# EAGLE design forcefoot (EAGLE 6.1)
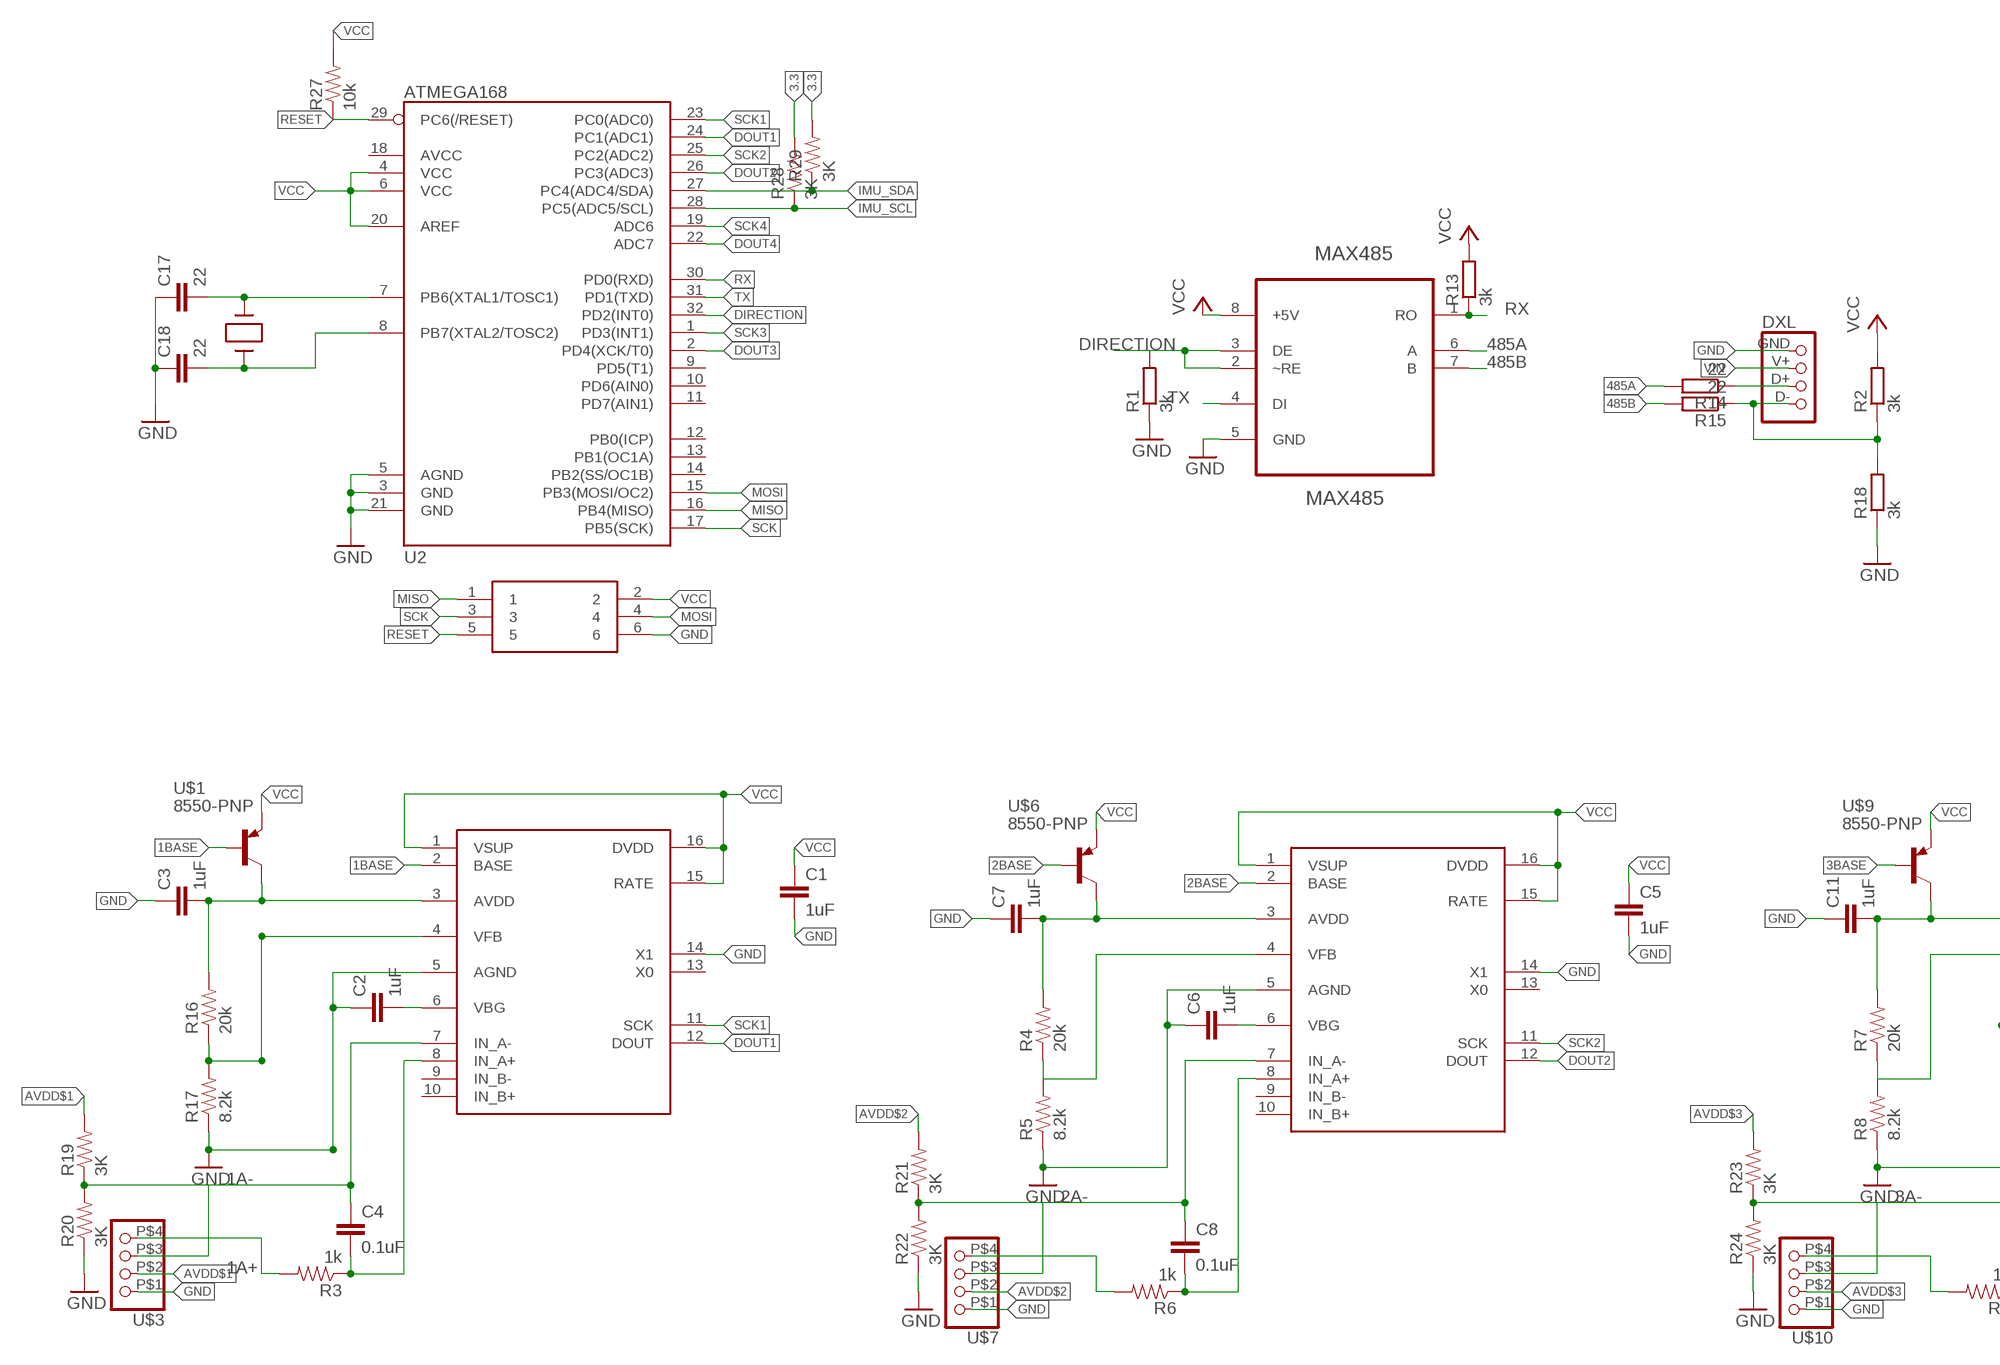
[diagram p0: schematic, sheet 1, part 1 of 2]
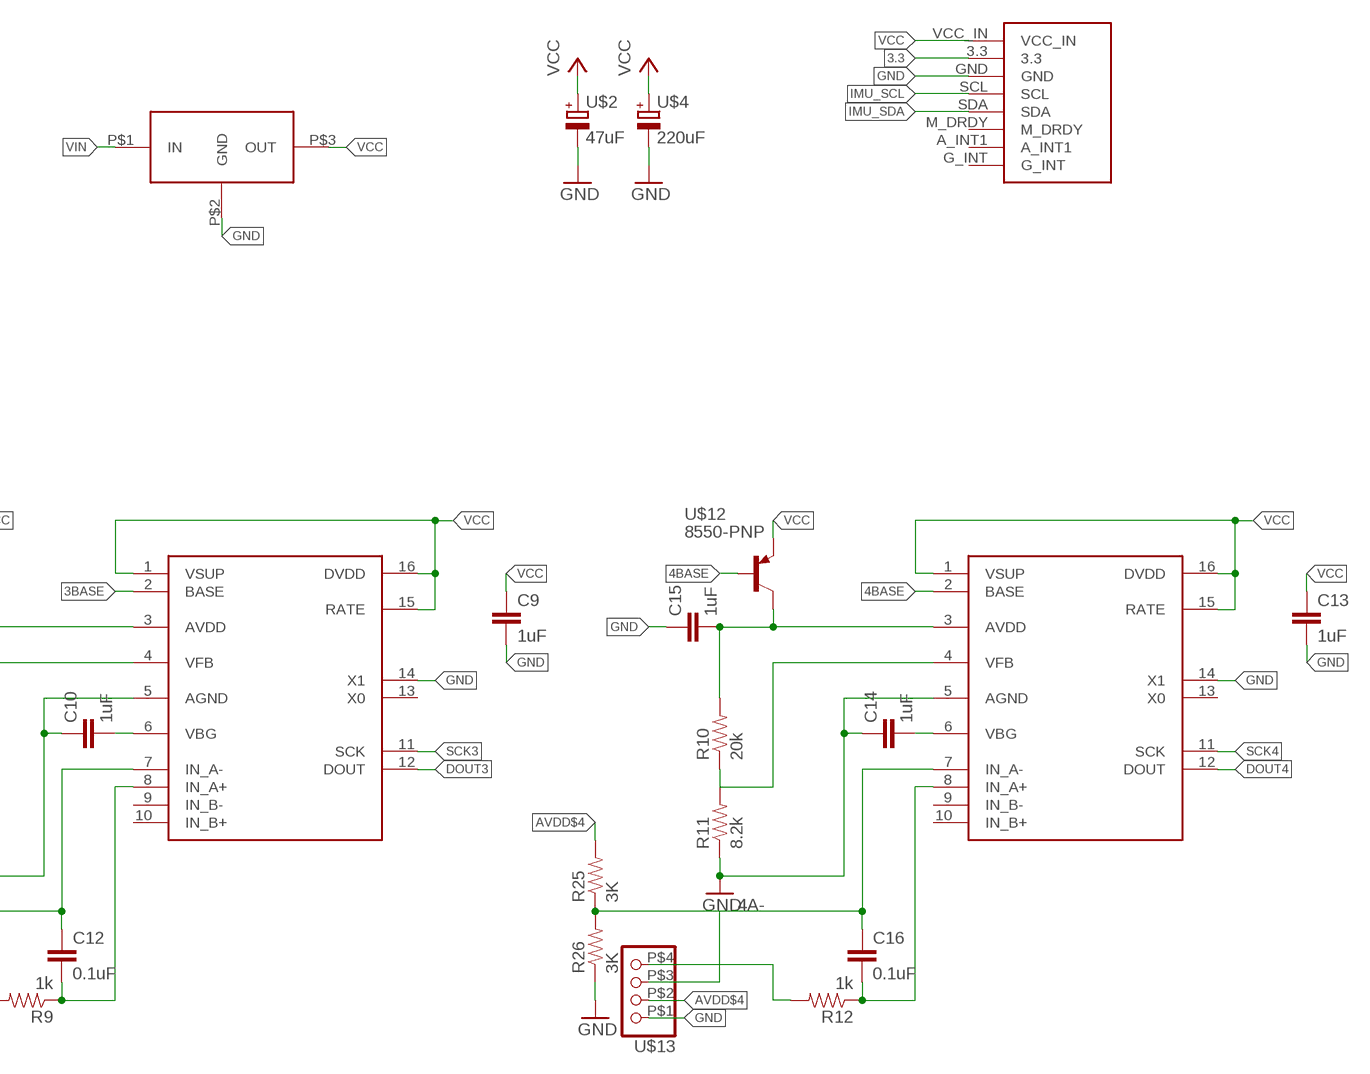
[diagram p1: schematic, sheet 1, part 2 of 2]

## Parts
C1  1uF  CAP0805  [0805]
C2  1uF  CAP0805  [0805]
C3  1uF  CAP0805  [0805]
C4  0.1uF  CAP0805  [0805]
C5  1uF  CAP0805  [0805]
C6  1uF  CAP0805  [0805]
C7  1uF  CAP0805  [0805]
C8  0.1uF  CAP0805  [0805]
C9  1uF  CAP0805  [0805]
C10  1uF  CAP0805  [0805]
C11  1uF  CAP0805  [0805]
C12  0.1uF  CAP0805  [0805]
C13  1uF  CAP0805  [0805]
C14  1uF  CAP0805  [0805]
C15  1uF  CAP0805  [0805]
C16  0.1uF  CAP0805  [0805]
C17  22  C_EU_22PF  [C0603]
C18  22  C_EU_22PF  [C0603]
DXL  CONNEC_1X04_485  [CONNEC_485]
HX1  HX711SO16  [SO16]
HX2  HX711SO16  [SO16]
HX3  HX711SO16  [SO16]
HX4  HX711SO16  [SO16]
IMU  GY-85  [GY-85]
ISP  CONNEC_2X03  [CONNEC_2X03]
MAX485  MAX485  [SO8]
R1  3k  RESISTANCE-R0805  [R0805]
R2  3k  RESISTANCE-R0805  [R0805]
R3  1k  RESISTOR0805-RES  [0805]
R4  20k  RESISTOR0805-RES  [0805]
R5  8.2k  RESISTOR0805-RES  [0805]
R6  1k  RESISTOR0805-RES  [0805]
R7  20k  RESISTOR0805-RES  [0805]
R8  8.2k  RESISTOR0805-RES  [0805]
R9  1k  RESISTOR0805-RES  [0805]
R10  20k  RESISTOR0805-RES  [0805]
R11  8.2k  RESISTOR0805-RES  [0805]
R12  1k  RESISTOR0805-RES  [0805]
R13  3k  RESISTANCE-R0805  [R0805]
R14  22  RESISTANCE-R0805  [R0805]
R15  22  RESISTANCE-R0805  [R0805]
R16  20k  RESISTOR0805-RES  [0805]
R17  8.2k  RESISTOR0805-RES  [0805]
R18  3k  RESISTANCE-R0805  [R0805]
R19  3K  RESISTOR0805-RES  [0805]
R20  3K  RESISTOR0805-RES  [0805]
R21  3K  RESISTOR0805-RES  [0805]
R22  3K  RESISTOR0805-RES  [0805]
R23  3K  RESISTOR0805-RES  [0805]
R24  3K  RESISTOR0805-RES  [0805]
R25  3K  RESISTOR0805-RES  [0805]
R26  3K  RESISTOR0805-RES  [0805]
R27  10k  RESISTOR0805-RES  [0805]
R28  3K  RESISTOR0805-RES  [0805]
R29  3K  RESISTOR0805-RES  [0805]
REG  REG_5V  [TRACOPOWER]
U2  ATMEGA168  [TQFP32-08]
U$1  8550-PNP  [SOT-23]
U$2  47uF  CPOL_EUPANASONIC_D  [PANASONIC_D]
U$3  CONNEC_1X041.5  [4P1.5]
U$4  220uF  CPOL_EUPANASONIC_D8  [PANASONIC_D8]
U$6  8550-PNP  [SOT-23]
U$7  CONNEC_1X041.5  [4P1.5]
U$9  8550-PNP  [SOT-23]
U$10  CONNEC_1X041.5  [4P1.5]
U$12  8550-PNP  [SOT-23]
U$13  CONNEC_1X041.5  [4P1.5]
XTAL1  QUARTZ  [HC49US]

## Nets
1A+: R3.2 U$3.P$4
1A-: C4.1 HX1.7(IN_A-) R19.1 R20.2 U$3.P$3
1BASE: HX1.2(BASE) U$1.1(B)
2A-: C8.1 HX2.7(IN_A-) R21.1 R22.2 U$7.P$3
2BASE: HX2.2(BASE) U$6.1(B)
3.3: IMU.3.3 R28.2 R29.2
3A-: C12.1 HX3.7(IN_A-) R23.1 R24.2 U$10.P$3
3BASE: HX3.2(BASE) U$9.1(B)
4A-: C16.1 HX4.7(IN_A-) R25.1 R26.2 U$13.P$3
4BASE: HX4.2(BASE) U$12.1(B)
485A: MAX485.6(A) R14.2
485B: MAX485.7(B) R15.2
AVDD$1: C3.2 HX1.3(AVDD) R16.2 R19.2 U$1.3(C) U$3.P$2
AVDD$2: C7.2 HX2.3(AVDD) R4.2 R21.2 U$6.3(C) U$7.P$2
AVDD$3: C11.2 HX3.3(AVDD) R7.2 R23.2 U$9.3(C) U$10.P$2
AVDD$4: C15.2 HX4.3(AVDD) R10.2 R25.2 U$12.3(C) U$13.P$2
DIRECTION: MAX485.2(~RE) MAX485.3(DE) R1.2 U2.32(PD2(INT0))
DOUT1: HX1.12(DOUT) U2.24(PC1(ADC1))
DOUT2: HX2.12(DOUT) U2.26(PC3(ADC3))
DOUT3: HX3.12(DOUT) U2.2(PD4(XCK/T0))
DOUT4: HX4.12(DOUT) U2.22(ADC7)
GND: C1.2 C2.1 C3.1 C5.2 C6.1 C7.1 C9.2 C10.1 C11.1 C13.2 C14.1 C15.1 C17.1 C18.1 DXL.GND HX1.5(AGND) HX1.14(X1) HX2.5(AGND) HX2.14(X1) HX3.5(AGND) HX3.14(X1) HX4.5(AGND) HX4.14(X1) IMU.GND ISP.6 MAX485.5(GND) R1.1 R5.1 R8.1 R11.1 R17.1 R18.1 R20.1 R22.1 R24.1 R26.1 REG.P$2(GND) U2.3(GND) U2.5(AGND) U2.21(GND) U$2.- U$3.P$1 U$4.- U$7.P$1 U$10.P$1 U$13.P$1
IMU_SCL: IMU.SCL R28.1 U2.28(PC5(ADC5/SCL))
IMU_SDA: IMU.SDA R29.1 U2.27(PC4(ADC4/SDA))
INAP$1: C4.2 HX1.8(IN_A+) R3.1
INAP$2: C8.2 HX2.8(IN_A+) R6.1
INAP$3: C12.2 HX3.8(IN_A+) R9.1
INAP$4: C16.2 HX4.8(IN_A+) R12.1
MISO: ISP.1 U2.16(PB4(MISO))
MOSI: ISP.4 U2.15(PB3(MOSI/OC2))
N$1: C2.2 HX1.6(VBG)
N$3: C6.2 HX2.6(VBG)
N$4: R6.2 U$7.P$4
N$5: C10.2 HX3.6(VBG)
N$6: R9.2 U$10.P$4
N$7: C14.2 HX4.6(VBG)
N$8: R12.2 U$13.P$4
N$19: C17.2 U2.7(PB6(XTAL1/TOSC1)) XTAL1.2
N$20: C18.2 U2.8(PB7(XTAL2/TOSC2)) XTAL1.1
RESET: ISP.5 R27.1 U2.29(PC6(/RESET))
RS+: DXL.D+ R14.1
RS-: DXL.D- R2.1 R15.1 R18.2
RX: MAX485.1(RO) R13.1 U2.30(PD0(RXD))
SCK: ISP.3 U2.17(PB5(SCK))
SCK1: HX1.11(SCK) U2.23(PC0(ADC0))
SCK2: HX2.11(SCK) U2.25(PC2(ADC2))
SCK3: HX3.11(SCK) U2.1(PD3(INT1))
SCK4: HX4.11(SCK) U2.19(ADC6)
TX: MAX485.4(DI) U2.31(PD1(TXD))
VCC: C1.1 C5.1 C9.1 C13.1 HX1.1(VSUP) HX1.15(RATE) HX1.16(DVDD) HX2.1(VSUP) HX2.15(RATE) HX2.16(DVDD) HX3.1(VSUP) HX3.15(RATE) HX3.16(DVDD) HX4.1(VSUP) HX4.15(RATE) HX4.16(DVDD) IMU.VCC_IN ISP.2 MAX485.8(+5V) R2.2 R13.2 R27.2 REG.P$3(OUT) U2.4(VCC) U2.6(VCC) U2.20(AREF) U$1.2(E) U$2.+ U$4.+ U$6.2(E) U$9.2(E) U$12.2(E)
VFB$1: HX1.4(VFB) R16.1 R17.2
VFB$2: HX2.4(VFB) R4.1 R5.2
VFB$3: HX3.4(VFB) R7.1 R8.2
VFB$4: HX4.4(VFB) R10.1 R11.2
VIN: DXL.V+ REG.P$1(IN)
Unconnected: HX1.9(IN_B-) HX1.10(IN_B+) HX1.13(X0) HX2.9(IN_B-) HX2.10(IN_B+) HX2.13(X0) HX3.9(IN_B-) HX3.10(IN_B+) HX3.13(X0) HX4.9(IN_B-) HX4.10(IN_B+) HX4.13(X0) IMU.A_INT1 IMU.G_INT IMU.M_DRDY U2.9(PD5(T1)) U2.10(PD6(AIN0)) U2.11(PD7(AIN1)) U2.12(PB0(ICP)) U2.13(PB1(OC1A)) U2.14(PB2(SS/OC1B)) U2.18(AVCC)

## Library data of the parts
C1-C3 C5-C7 C9-C11 C13-C15 = SparkFun-Passives:CAP: Capacitor Standard 0603 ceramic capacitor, and 0.1" leaded capacitor.; FARNELL: 2525136RL
C4 C8 C12 C16 = SparkFun-Passives:CAP: Capacitor Standard 0603 ceramic capacitor, and 0.1" leaded capacitor.; FARNELL: 2688486RL
C17 C18 = rhoban:C_EU: non polarised condo; FARNELL: 1759489RL
DXL = rhoban:CONNEC_1X04; FARNELL: 1104204 OR 9979620
HX1-HX4 = rhoban:HX711; FARNELL: HX711
IMU = rhoban:GY-85; FARNELL: -
ISP = rhoban:CONNEC_2X03; FARNELL: 1593440
MAX485 = rhoban:MAX485; DATASHEET: max485.pdf; DESCRIPTION: ±15kV ESD-Protected, Slew-Rate-Limited, Low-Power, RS-485/RS-422 Transceivers; FARNELL: 1564306; FARNELL_LINK: http://fr.farnell.com/maxim-integrated-products/max485eesa/transceiver-rs-485-422-cms/dp/1379973?Ntt=1379973; MPN: MAX485EESA+; OC_FARNELL: 1379973; OC_NEWARK: 68K4798; PACKAGE: SOIC-8; SUPPLIER: Maxim
R1 R2 R13 R18 = rhoban:RESISTANCE: RESISTOR, European symbol; FARNELL: 2074431
R3 R6 R9 R12 = SparkFun-Passives:RESISTOR: Resistor Basic schematic elements and footprints for 0603, 1206, and PTH resistors.; FARNELL: 2074332RL
R4 R7 R10 R16 = SparkFun-Passives:RESISTOR: Resistor Basic schematic elements and footprints for 0603, 1206, and PTH resistors.; FARNELL: 2074395
R5 R8 R11 R17 = SparkFun-Passives:RESISTOR: Resistor Basic schematic elements and footprints for 0603, 1206, and PTH resistors.; FARNELL: 2074518
R14 R15 = rhoban:RESISTANCE: RESISTOR, European symbol; FARNELL: 2446926
R19-R26 R28 R29 = SparkFun-Passives:RESISTOR: Resistor Basic schematic elements and footprints for 0603, 1206, and PTH resistors.; FARNELL: 2074431
R27 = SparkFun-Passives:RESISTOR: Resistor Basic schematic elements and footprints for 0603, 1206, and PTH resistors.; FARNELL: 2074334RL
REG = rhoban:REG_5V; FARNELL: 1696320
U2 = SparkFun-DigitalIC:ATMEGA168: Atmel 32-pin 8-bit micro, 16k flash.; FARNELL: 2523203
U$1 U$6 U$9 U$12 = rhoban:8550-PNP; FARNELL: 1095136
U$2 = rhoban:CPOL_EU: 680 uF 16 V : http://fr.farnell.com/panasonic/eeufr1c681l/condensateur-radial-16v-680uf/dp/1800635 680 uF 25 V : http://fr.farnell.com/panasonic/eeufr1e681l/capacitor-radial-25v-680uf-20/dp/2063069 330 uF 25 V : http://fr.farnell.com/panasonic/eeufr1e331/condensateur-radial-25v-330uf/dp/1800648?Ntt=eeufr1e331; FARNELL: 9696946
U$3 U$7 U$10 U$13 = rhoban:CONNEC_1X04; FARNELL: 9491791
U$4 = rhoban:CPOL_EU: 680 uF 16 V : http://fr.farnell.com/panasonic/eeufr1c681l/condensateur-radial-16v-680uf/dp/1800635 680 uF 25 V : http://fr.farnell.com/panasonic/eeufr1e681l/capacitor-radial-25v-680uf-20/dp/2063069 330 uF 25 V : http://fr.farnell.com/panasonic/eeufr1e331/condensateur-radial-25v-330uf/dp/1800648?Ntt=eeufr1e331; FARNELL: 1850103
XTAL1 = rhoban:QUARTZ; FARNELL: 7940506

## Board
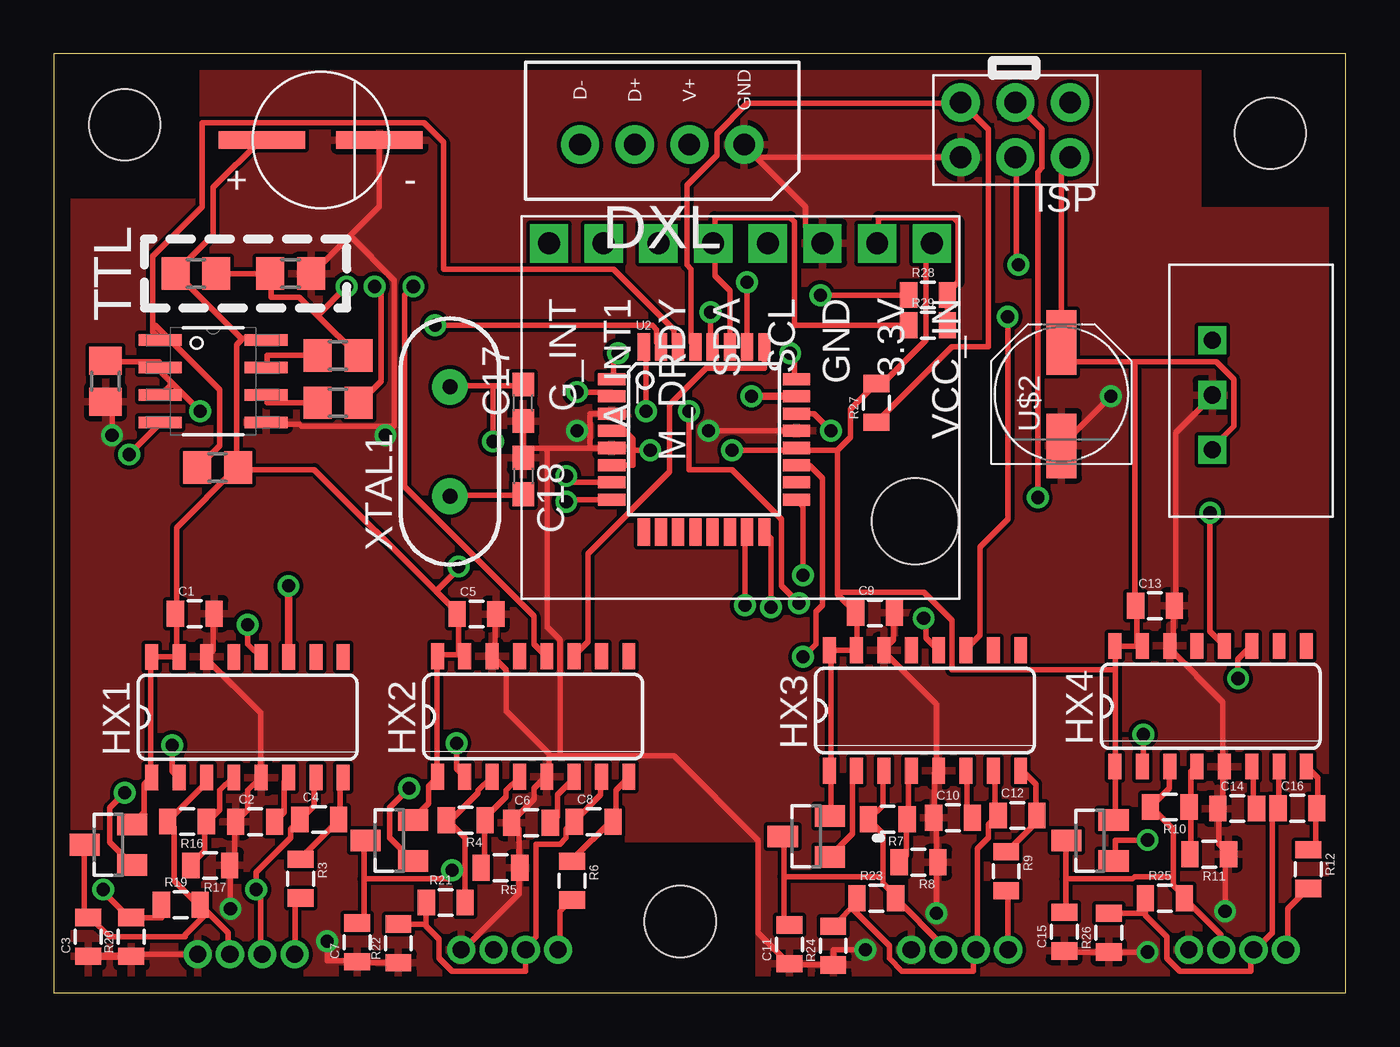
[diagram p2: board, top side]
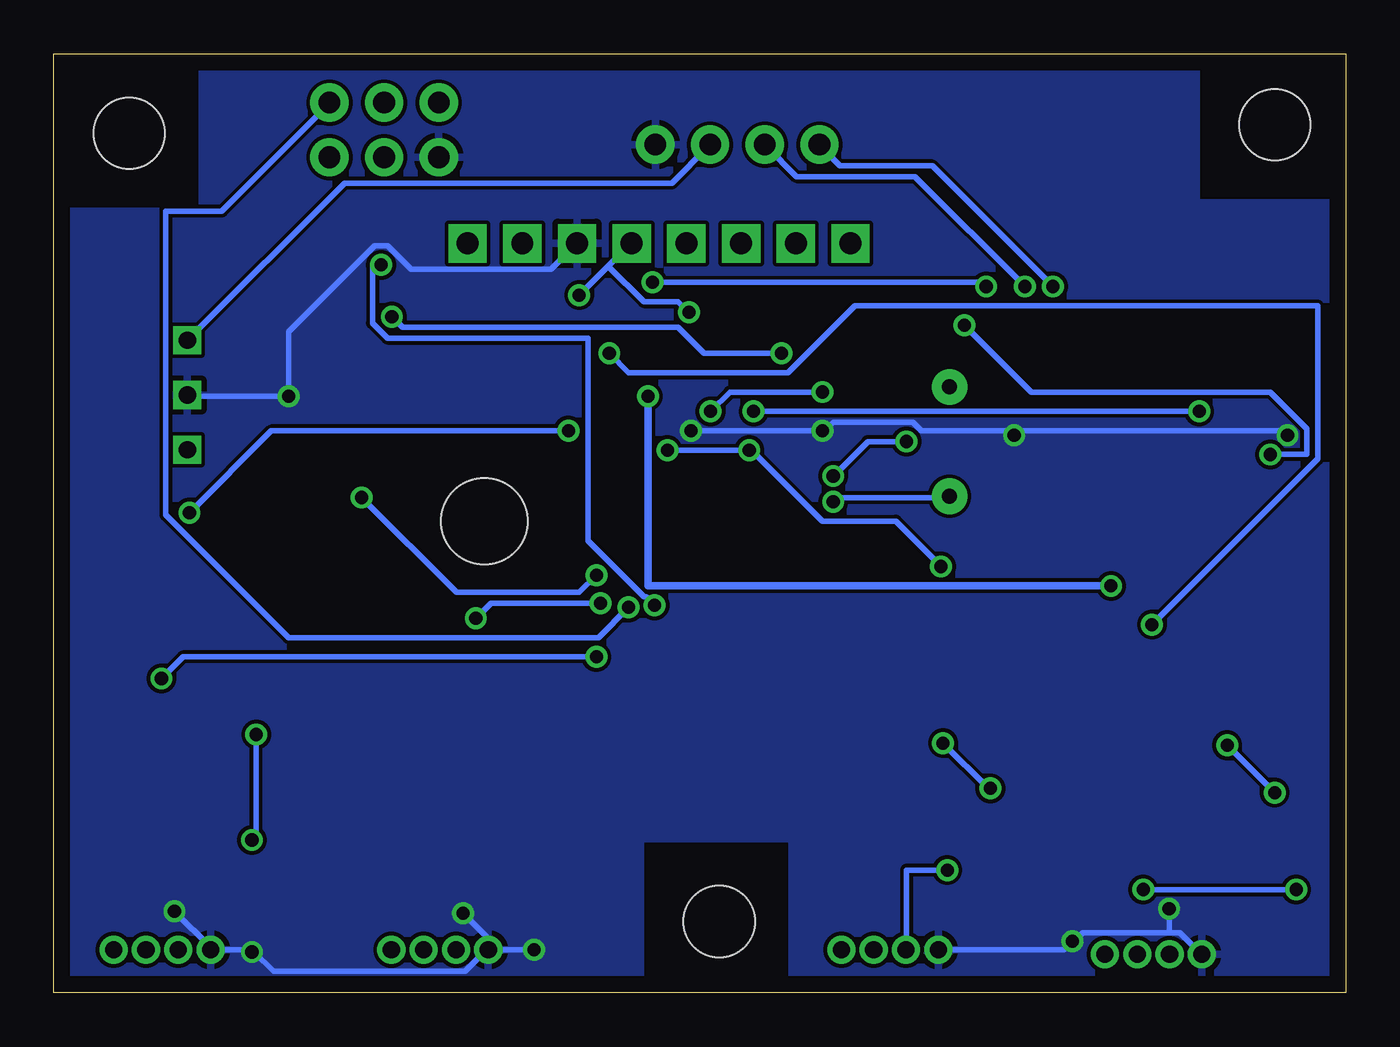
[diagram p3: board, bottom side, seen from below]

Size 60 x 43.6 mm. Coordinates in mm from the lower left corner, seen from the top.
Outline: 0,0 60,0 60,43.6 0,43.6 0,0
Copper layers (1*16): Top 0.035mm / dielectric 1.5mm / Bottom 0.035mm
Design rules: minimum track width 10mil, minimum drill 24mil, track to track 7mil, track to pad 7mil, pad to pad 7mil, via to via 7mil, smd to smd 7mil, copper to edge 30mil, drill to drill 8mil, minimum pad ring 10mil, minimum via ring 8mil, stop-mask expansion 4mil, vias tented up to drill 0mil, thermal gap 10mil
tRestrict: area 0.1,36.9 to 6.8,44; area 53.3,36.5 to 60,43.6; area 25.9,-0.1 to 32.6,7
bRestrict: area 0.1,36.9 to 6.8,44; area 53.3,36.5 to 60,43.6; area 25.9,-0.1 to 32.6,7

### Footprints (pad centres in the part's own frame; a part is rotated, then mirrored left to right if it is on the bottom)
0805 = smd 0.8 x 1.2: 1 -0.9,0; 2 0.9,0
C0603 = smd 1.1 x 1: 1 -0.85,0; 2 0.85,0
CONNEC_485 = drill 1 pad 1.778: D+ 7.62,3.81; D- 10.16,3.81; GND 2.54,3.81; V+ 5.08,3.81
SO16 = smd 1.2 x 0.6: 1 -2.8,4.445; 2 -2.8,3.175; 3 -2.8,1.905; 4 -2.8,0.635; 5 -2.8,-0.635; 6 -2.8,-1.905; 7 -2.8,-3.175; 8 -2.8,-4.445; 9 2.8,-4.445; 10 2.8,-3.175; 11 2.8,-1.905; 12 2.8,-0.635; 13 2.8,0.635; 14 2.8,1.905; 15 2.8,3.175; 16 2.8,4.445
GY-85 = drill 1.016 pad 1.778 square: 3.3 0,15.24; A_INT1 0,2.54; G_INT 0,0; GND 0,12.7; M_DRDY 0,5.08; SCL 0,10.16; SDA 0,7.62; VCC_IN 0,17.78 | hole 4: 12.9,17
CONNEC_2X03 = drill 1.016 pad 1.778: 1 0,-2.54; 2 0,0; 3 2.54,-2.54; 4 2.54,0; 5 5.08,-2.54; 6 5.08,0
SO8 = smd 1.981 x 0.533: 1 -2.464,1.905; 2 -2.464,0.635; 3 -2.464,-0.635; 4 -2.464,-1.905; 5 2.464,-1.905; 6 2.464,-0.635; 7 2.464,0.635; 8 2.464,1.905
R0805 = smd 1.3 x 1.5: 1 -0.95,0; 2 0.95,0
TRACOPOWER = drill 0.8 square: P$1 3.5,2; P$2 6.04,2; P$3 8.58,2
TQFP32-08 = smd 1.27 x 0.559: 1 -4.293,2.8; 2 -4.293,2; 3 -4.293,1.2; 4 -4.293,0.4; 5 -4.293,-0.4; 6 -4.293,-1.2; 7 -4.293,-2; 8 -4.293,-2.8; 17 4.293,-2.8; 18 4.293,-2; 19 4.293,-1.2; 20 4.293,-0.4; 21 4.293,0.4; 22 4.293,1.2; 23 4.293,2; 24 4.293,2.8 | smd 0.559 x 1.27: 9 -2.8,-4.293; 10 -2,-4.293; 11 -1.2,-4.293; 12 -0.4,-4.293; 13 0.4,-4.293; 14 1.2,-4.293; 15 2,-4.293; 16 2.8,-4.293; 25 2.8,4.293; 26 2,4.293; 27 1.2,4.293; 28 0.4,4.293; 29 -0.4,4.293; 30 -1.2,4.293; 31 -2,4.293; 32 -2.8,4.293
SOT-23 = smd 1 x 1.4: 1 -0.95,-1.1; 2 0.95,-1.1; 3 0,1.1
PANASONIC_D = smd 3 x 1.4: + 2.4,0; - -2.4,0
4P1.5 = drill 0.8: P$1 0,0; P$2 1.5,0; P$3 3,0; P$4 4.5,0
PANASONIC_D8 = smd 4.016 x 0.8: + 2.73,0; - -2.73,0
STAND-OFF = hole 3.302: 0,0
HC49US = drill 0.7 pad 1.651: 1 -2.54,0; 2 2.54,0

### Placement (x,y rotation side)
C1  6.55,17.61 0 top
C2  9.35,7.95 0 top
C3  1.6,2.6 90 top
C4  12.33,8.05 0 top
C5  19.63,17.59 0 top
C6  22.16,7.9 0 top
C7  14.09,2.35 90 top
C8  25.07,7.95 0 top
C9  38.14,17.64 0 top
C10  41.76,8.13 0 top
C11  34.16,2.25 90 top
C12  44.76,8.24 0 top
C13  51.14,17.97 0 top
C14  54.96,8.56 0 top
C15  46.93,2.85 90 top
C16  57.76,8.57 0 top
C17  21.8,27.4 90 top
C18  21.8,24 270 top
DXL  34.6,43.2 180 top
HX1  9,12.8 90 top
HX2  22.26,12.83 90 top
HX3  40.46,13.11 90 top
HX4  53.73,13.31 90 top
IMU  23,34.8 270 top
ISP  47.2,38.8 180 top
MAX485  7.4,28.4 0 top
R1  2.4,28.4 90 top
R2  6.6,33.4 180 top
R3  11.46,5.31 270 top
R4  19.13,8.01 180 top
R5  20.74,5.81 180 top
R6  24.07,5.21 270 top
R7  38.73,8.06 180 top
R8  40.16,6.07 180 top
R9  44.23,5.65 270 top
R10  51.83,8.63 180 top
R11  53.66,6.44 180 top
R12  58.26,5.75 270 top
R13  7.6,24.4 0 top
R14  13.2,27.4 180 top
R15  13.2,29.6 180 top
R16  6.19,7.96 180 top
R17  7.26,5.92 180 top
R18  11,33.4 180 top
R19  5.9,4.1 0 top
R20  3.6,2.6 90 top
R21  18.2,4.2 0 top
R22  16,2.3 90 top
R23  38.2,4.4 0 top
R24  36.2,2.2 90 top
R25  51.6,4.4 0 top
R26  49,2.8 90 top
R27  38.2,27.4 90 top
R28  40.6,32.4 0 top
R29  40.6,31 0 top
REG  51.8,33.8 270 top
U2  30.2,25.7 0 top
U$1  2.54,6.88 90 top
U$2  46.8,27.8 90 top
U$3  6.68,1.8 0 top
U$4  12.4,39.6 180 top
U$6  15.58,7.08 90 top
U$7  18.92,2 0 top
U$9  34.95,7.27 90 top
U$10  39.82,2 0 top
U$11  [STAND-OFF]  3.3,40.31 0 top
U$12  48.12,7.07 90 top
U$13  52.72,2 0 top
U$14  [STAND-OFF]  56.5,39.91 0 top
U$16  [STAND-OFF]  29.1,3.31 0 top
XTAL1  18.4,25.6 90 top

### Tracks (layer width: path | path; a pad name or v marks a point on that pad's centre or on a via)
1A+
  Top 0.254: R3.2 11.4,4.4 11.2,4.2 11.2,1.8 U$3.P$4
1A-  (via drill 0.61)
  Top 0.254: HX1.7 12.1,10 12.1,8.7 11.5,8.1 C4.1 11.4,8 11,7.6 11,7.2 9.4,5.6 v9.4,4.8 9.6,4.6 9.6,1.8 U$3.P$3 | R19.1 5,3.5 R20.2 3.5,3.5 2.3,4.7 v2.3,4.8
  Bottom 0.254: v9.4,4.8 v2.3,4.8
1BASE  (via drill 0.61)
  Top 0.254: v5.5,11.5 5.5,10.3 5.8,10 HX1.2 | v3.3,9.3 2.6,8.6 2.6,7 3.6,6 U$1.1
  Bottom 0.254: v3.3,9.3 v5.5,11.5
2A-
  Top 0.254: HX2.7 25.4,10 25.4,9.2 24.2,8 C8.1 24.1,7.9 23.8,7.6 23.8,7.2 23.5,6.9 22.4,6.9 22.4,2.6 21.9,2.1 U$7.P$3 21.9,2 21.9,1 18.5,1 17.9,1.6 17.9,2.5 17.3,3.1 17.3,3.2 | 17.3,3.2 R22.2 | R21.1 17.3,3.2
2BASE  (via drill 0.61)
  Top 0.254: v18.7,11.6 18.7,10.4 19,10.1 HX2.2 | v16.5,9.5 15.6,8.6 15.6,7.2 16.6,6.2 U$6.1
  Bottom 0.254: v18.7,11.6 16.6,9.5 v16.5,9.5
3.3
  Top 0.254: R29.2 R28.2 41.5,32.5 42,33 42,35.8 41.8,36 38.3,36 38.3,34.8 IMU.3.3
3A-
  Top 0.254: R24.2 37.3,4.2 R23.1 37.1,3.9 38.8,2.2 38.8,1.6 39.4,1 42.7,1 42.7,2 U$10.P$3 42.9,2 42.9,6.7 43.4,7.2 43.4,7.8 43.8,8.2 C12.1 43.7,8.4 43.7,10.3 HX3.7
3BASE
  Top 0.254: HX3.2 37.2,10.3 37.1,10.2 37.1,7.4 36.1,6.4 U$9.1
4A-
  Top 0.254: 50.7,3.7 R26.2 | R25.1 50.7,3.7 | HX4.7 56.9,8.6 C16.1 56.8,8.5 56.6,8.3 56.6,2.8 55.8,2 U$13.P$3 55.6,2 55.6,1 52.3,1 51.7,1.6 51.7,2.6 50.7,3.6 50.7,3.7
4BASE  (via drill 0.61)
  Top 0.254: v50.6,12 50.6,10.6 HX4.2 | v50.8,7.1 49.3,7.1 49.3,6.2 U$12.1
  Bottom 0.254: v50.6,12 50.6,7.1 v50.8,7.1
485A
  Top 0.254: R14.2 9.9,27.4 9.9,27.7 MAX485.6
485B
  Top 0.254: R15.2 9.9,29.6 9.9,29.1 MAX485.7
AVDD$1
  Top 0.254: HX1.3 7,10 7,9.7 5.3,8 R16.2 5.4,7.9 5.6,7.7 5.6,5.2 6.7,4.1 R19.2 | U$1.3 1.4,6.8 1.4,3.7 C3.2 1.7,3.5 2.6,2.6 6.1,2.6 6.1,2.7 7.1,3.7 R19.2 | R19.2 8.1,2.8 8.1,1.8 U$3.P$2
AVDD$2  (via drill 0.61)
  Top 0.254: 14.4,5.3 14.4,7 U$6.3 | 14.4,5.3 14.4,3.6 14.1,3.3 C7.2 | R21.2 19.1,5.7 | 19.1,5.7 19.1,7.2 18.3,8 R4.2 18.4,8 19.7,9.3 19.7,9.4 20.3,10 HX2.3 | 19.1,5.7 v18.5,5.7 18.4,5.7 18.4,5.3 14.4,5.3
  Bottom 0.254: v18.5,5.7 20.4,5.7 20.4,2 U$7.P$2
AVDD$3
  Top 0.254: 33.9,5.4 33.9,7.2 U$9.3 | 33.9,5.4 33.9,3.4 34.1,3.2 C11.2 | HX3.3 38.5,10.3 38.5,8.7 37.9,8.1 R7.2 37.9,8 38.5,7.4 38.5,5.4 | U$10.P$2 41.3,2 41.3,2.2 R23.2 39.1,4.5 38.5,5.1 38.5,5.4 | 38.5,5.4 33.9,5.4
AVDD$4
  Top 0.254: 47,5.3 47,7 U$12.3 | 47,5.3 47,3.8 C15.2 | HX4.3 51.8,10.5 51.8,9.5 R10.2 51,8.6 52,7.6 52,5.4 | U$13.P$2 54.2,2 54.2,2.7 R25.2 52.5,4.5 52,5 52,5.4 | 47,5.3 50.1,5.3 50.2,5.4 52,5.4
DIRECTION  (via drill 0.61)
  Top 0.254: v27.5,27 27.5,29.8 27.4,29.9 U2.32 | 5.45,28.35 5,28.8 5,29 MAX485.2 4.9,29.1 4.9,29.3 2.4,29.3 R1.2 | 5.45,28.35 v6.8,27 | MAX485.3 5,27.8 5.4,28.2 5.4,28.3 5.45,28.35
  Bottom 0.254: v6.8,27 v27.5,27
DOUT1  (via drill 0.61)
  Top 0.254: v9,17.1 9,16.2 9.6,15.6 HX1.12 | v34.2,29.7 34.4,29.5 34.4,28.5 U2.24
  Bottom 0.254: v9,17.1 1.3,24.8 1.3,31.9 22.8,31.9 25.9,28.8 33.3,28.8 v34.2,29.7
DOUT2  (via drill 0.61)
  Top 0.254: v16.7,32.8 16.3,32.4 16.3,23.5 22.3,17.5 22.3,16.2 22.8,15.7 HX2.12 | U2.26 v32.2,33
  Bottom 0.254: v16.7,32.8 16.9,33 v32.2,33
DOUT3  (via drill 0.61)
  Top 0.254: v40.4,17.4 40.5,17.3 40.5,16.5 41,16 HX3.12 | v34.6,18.1 33.8,18.9 33.8,22 31.5,24.3 29.5,24.3 v29.5,27 | v24.3,27.9 25.9,27.9 U2.2
  Bottom 0.254: v40.4,17.4 39.7,18.1 v34.6,18.1 | v29.5,27 28.6,27.9 v24.3,27.9
DOUT4  (via drill 0.61)
  Top 0.254: v53.7,22.3 53.7,16.8 54.3,16.2 HX4.12 | v36.1,26.1 35.3,26.9 U2.22
  Bottom 0.254: v53.7,22.3 49.9,26.1 v36.1,26.1
GND  (via drill 0.61)
  Top 0.254: IMU.GND 34.9,35.6 34.9,36.5 32.1,39.3 DXL.GND 32.7,38.8 ISP.6 | REG.P$2 53.8,27.7 52.1,26 52.1,18 C13.2 52,17.9 52,16.3 51.9,16.2 HX4.14 51.8,16 54.3,13.5 54.3,10.6 HX4.5 54.3,10.5 54.3,8.8 C14.1 54.1,8.5 54.1,6.9 R11.1 54.5,6.4 54.4,6.3 v54.4,3.8 | v49.1,27.7 U$2.- | 13.75,35.15 15.1,36.5 15.1,39.6 U$4.- | 13.75,35.15 12,33.4 R18.1 | 15.4,26.3 15.8,26.3 15.8,33.1 13.75,35.15 | 15.4,26.3 11.5,26.3 11.4,26.4 9.9,26.4 MAX485.5 | C17.1 C18.1 21.9,25.3 22.9,25.3 | 22.9,25.3 24.9,25.3 | 24.9,25.3 U2.5 | U2.3 24.9,26.9 24.9,26.1 | 24.9,25.3 24.9,26.1 | v30.4,26.1 U2.21 | 24.9,26.1 v24.3,26.1 | v2.7,25.9 2.7,27.1 2.4,27.4 R1.1 | v15.4,25.9 15.4,26.3 | C1.2 7.4,17.6 7.4,15.9 HX1.14 7.1,15.5 9.6,13 9.6,10.1 HX1.5 9.6,10 9,9.4 9,8.5 C2.1 8.4,7.9 8.4,6.2 8.2,6 R17.1 8.2,5.8 v8.2,3.9 | U$3.P$1 3.7,1.8 R20.1 | R22.1 14.1,1.4 C7.1 14,1.5 12.7,1.5 v12.7,2.4 | C9.2 39,17.6 39,16.4 38.6,16 HX3.14 38.6,15.8 41,13.4 41,10.4 HX3.5 41,10.3 40.9,10.2 40.9,8.2 C10.1 40.9,8.1 41,8 41,6.1 R8.1 41,6 v41,3.7 | C15.1 47,1.9 R26.1 v50.8,1.9 | C5.2 20.5,17.5 20.5,15.8 20.4,15.7 HX2.14 20.4,15.6 21,15 21,13.1 23,11.1 23,11 | 23,11 23.5,11 | 23.5,11 28.8,11 32.7,7.1 32.7,2.8 34.1,1.4 C11.1 34.2,1.3 R24.1 36.2,2 v37.7,2 | 23,11 23,10.1 HX2.5 22.8,10 22.3,9.5 22.3,9 21.3,8 C6.1 21.3,7.9 21.6,7.6 21.6,5.9 R5.1 21.6,5.7 21.6,4.6 19,2 U$7.P$1 | 22.9,25.3 22.9,17 23.5,16.4 23.5,11
  Top 0.35: C3.1 R20.1
  Bottom 0.254: REG.P$2 53.8,27.7 v49.1,27.7 49.1,30.7 45.1,34.7 44.5,34.7 43.4,33.6 36.9,33.6 IMU.GND | v30.4,26.1 v24.3,26.1 24.2,26.1 23.8,26.5 20.1,26.5 19.7,26.1 15.4,26.1 | v2.7,25.9 2.9,26.1 15.4,26.1 | v15.4,25.9 15.4,26.1 | U$7.P$1 13.1,2 v12.7,2.4 12.6,2.4 12.2,2.8 8.2,2.8 | 8.2,2.8 7.7,2.8 6.7,1.8 U$3.P$1 | 8.2,2.8 v8.2,3.9 | U$10.P$1 39.9,2 40.9,1 49.8,1 50.7,1.9 v50.8,1.9 50.9,2 U$13.P$1 52.7,2.1 v54.4,3.8 | v41,3.7 39.9,2.6 39.9,2.1 U$10.P$1 | v37.7,2 U$10.P$1
  pour Bottom: -2.2,49.5 66.1,49.5 66.1,-4.9 -8.3,-4.9 -8.3,34.2
  pour Top: -3.2,47.4 61.8,47.4 61.8,-2.9 -10.7,-2.9 -10.7,36.5
IMU_SCL  (via drill 0.61)
  Top 0.254: v35.6,32.4 R28.1 | v30.5,31.6 30.5,30.1 U2.28
  Bottom 0.254: 34.25,33.75 33.2,34.8 IMU.SCL | 34.25,33.75 v35.6,32.4 | v30.5,31.6 31,32.1 32.6,32.1 34.25,33.75
IMU_SDA
  Top 0.254: R29.1 34.4,31 34.4,35.8 34.2,36 30.7,36 30.7,34.8 IMU.SDA 30.7,34.7 30.7,33.3 31.4,32.6 U2.27
INAP$1
  Top 0.254: R3.1 11.5,6.3 13.2,8 C4.2 13.3,8.1 13.3,9.9 13.4,10 HX1.8
INAP$2
  Top 0.254: R6.1 24.1,6.2 25.9,8 C8.2 25.9,8.1 26.1,8.3 26.1,9.4 26.7,10 HX2.8
INAP$3
  Top 0.254: R9.1 44.3,6.6 45.6,7.9 45.6,8.2 C12.2 45.6,8.3 45.6,9.7 45,10.3 HX3.8
INAP$4
  Top 0.254: R12.1 58.3,6.7 58.6,7 58.6,8.5 C16.2 58.7,8.7 58.7,10 58.2,10.5 HX4.8
MISO  (via drill 0.61)
  Top 0.254: v33.3,17.9 33.3,21.1 U2.16
  Bottom 0.254: v33.3,17.9 34.7,16.5 49.1,16.5 54.8,22.2 54.8,36.3 52.2,36.3 47.2,41.3 ISP.1
MOSI  (via drill 0.61)
  Top 0.254: v32.1,18 32.1,21.3 U2.15 | v44.8,33.8 44.7,33.9 44.7,38.8 ISP.4
  Bottom 0.254: v32.1,18 32.5,18.4 32.6,18.4 35.2,21 35.2,30.4 44.5,30.4 45.2,31.1 45.2,33.8 v44.8,33.8
N$1
  Top 0.254: C2.2 10.7,8.4 10.7,9.8 HX1.6
N$3
  Top 0.254: C6.2 23.1,7.9 23.4,8.2 23.4,9.2 24.1,9.9 24.1,10 HX2.6
N$4
  Top 0.254: R6.2 24,4.3 23.5,3.8 23.5,2 U$7.P$4
N$5
  Top 0.254: C10.2 42.6,8.2 42.4,8.4 42.4,10.3 HX3.6
N$6
  Top 0.254: R9.2 44.3,4.7 44.3,2 U$10.P$4
N$7
  Top 0.254: C14.2 55.8,8.6 55.7,8.7 55.7,10.5 HX4.6
N$8
  Top 0.254: R12.2 58.2,4.8 57.3,3.9 57.3,2 U$13.P$4
N$19  (via drill 0.61)
  Top 0.254: 20.4,28.2 18.4,28.2 XTAL1.2 | 20.4,28.2 21.8,28.2 C17.2 | U2.7 23.8,23.7 v23.8,24 | 20.4,28.2 v20.4,25.6
  Bottom 0.254: v23.8,24 22.2,25.6 v20.4,25.6
N$20  (via drill 0.61)
  Top 0.254: C18.2 21.8,23.1 18.4,23.1 XTAL1.1 | U2.8 23.8,22.9 v23.8,22.8
  Bottom 0.254: v23.8,22.8 23.6,23 18.4,23 XTAL1.1
RESET
  Top 0.254: R27.1 41.7,30 43.4,30 43.4,40.1 42.2,41.3 ISP.5 42,41.3 32.2,41.3 30.8,39.9 30.8,38.9 29.4,37.5 29.4,33.8 29.6,33.6 29.6,30.2 U2.29
RS+  (via drill 0.61)
  Top 0.254: v14.9,32.8 15.2,32.5 15.2,28.4 14.2,27.4 R14.1
  Bottom 0.254: v14.9,32.8 20,37.9 25.5,37.9 26.9,39.3 DXL.D+
RS-  (via drill 0.61)
  Top 0.254: R2.1 R18.2 10.1,33.3 10.1,32.3 11.4,32.3 12.25,31.45 | 12.25,31.45 14.1,29.6 R15.1 | 12.25,31.45 v13.6,32.8
  Bottom 0.254: v13.6,32.8 19.2,38.4 23.5,38.4 24.4,39.3 DXL.D-
RX
  Top 0.254: 4.6,31 4.6,30.7 4.9,30.4 MAX485.1 | 4.6,31 4.6,34.2 6.9,36.5 6.9,40.4 17.2,40.4 18.1,39.5 18.1,33.6 26,33.6 28.8,30.8 28.8,30.2 U2.30 | R13.1 6.7,24.4 7.7,25.4 7.7,28 4.7,31 4.6,31
SCK  (via drill 0.61)
  Top 0.254: v34.8,19.4 34.8,22.6 U2.17 | v45.7,23 45.7,38.1 45.9,38.3 45.9,40.1 ISP.3
  Bottom 0.254: v34.8,19.4 35.6,18.6 41.3,18.6 v45.7,23
SCK1  (via drill 0.6)
  Top 0.35: HX1.11 v10.9,18.9 | v32.4,27.7 U2.23
  Bottom 0.35: v10.9,18.9 32.4,18.9 v32.4,27.7
SCK2
  Top 0.254: U2.25 33,29 30.3,29 28.6,27.3 28.6,24.2 24.8,20.4 24.8,16.3 24.2,15.7 HX2.11
SCK3  (via drill 0.61)
  Top 0.254: v44.3,31.4 44.3,22 43,20.7 43,16.6 42.4,16 HX3.11 | v26.2,29.7 26,29.5 26,28.5 U2.1
  Bottom 0.254: v44.3,31.4 43.8,30.9 31,30.9 29.8,29.7 v26.2,29.7
SCK4  (via drill 0.61)
  Top 0.254: v55,14.6 55,15.5 55.6,16.1 HX4.11 | v34.8,15.6 35.4,16.2 35.4,17.7 35.7,18 35.7,23.9 35.1,24.5 U2.19
  Bottom 0.254: v55,14.6 54,15.6 v34.8,15.6
TX  (via drill 0.61)
  Top 0.254: v17.7,31 27.8,31 28,30.8 28,30.2 U2.31 | v3.5,25 4.9,26.4 MAX485.4
  Bottom 0.254: v17.7,31 14.6,27.9 3.5,27.9 1.8,26.2 1.8,25 v3.5,25
VCC  (via drill 0.61)
  Top 0.254: 8.7,30.4 5.7,33.4 R2.2 5.7,33.5 7.4,35.2 7.4,37.4 9.6,39.6 U$4.+ | 8.7,30.4 9.8,30.4 MAX485.8 | U$6.2 16.7,8.1 17.4,8.8 17.4,9.6 17.8,10 HX2.1 17.8,10.1 17.8,15.6 HX2.16 17.9,15.7 19,15.7 HX2.15 18.8,15.8 18.8,17.5 C5.1 18.7,17.7 17.75,18.65 | U$1.2 3.7,7.9 4.2,8.4 4.2,9.7 4.5,10 HX1.1 4.5,10.1 4.5,15.5 HX1.16 HX1.15 5.7,15.7 5.7,17.6 C1.1 5.7,17.7 5.7,21.6 8.5,24.4 R13.2 | 17.75,18.65 12.1,24.3 8.6,24.3 R13.2 | 8.7,30.4 8.7,30.3 8.5,30.1 8.5,24.5 R13.2 | U$12.2 49.3,8.1 49.3,10.5 HX4.1 49.3,10.6 49.3,15 | 49.3,15 49.3,16 HX4.16 49.3,16.1 50.5,16.1 HX4.15 50.3,16.2 50.3,17.9 C13.1 50.2,18.1 50.2,29.3 | 50.2,29.3 46.8,29.3 U$2.+ 46.8,38.4 ISP.2 | 50.2,29.3 54,29.3 54.8,28.5 54.8,26.3 53.8,25.3 REG.P$3 | U$9.2 36.1,8.3 36.1,10.3 HX3.1 36.1,10.4 36.1,15.8 HX3.16 36.1,15.9 37.2,15.9 HX3.15 37.3,16 37.3,17.6 C9.1 37.2,17.7 36.4,18.5 36.4,18.6 | U2.6 26.9,24.5 26.9,25.2 | 26.9,25.2 26.9,25.7 26.5,26.1 U2.4 | 36.4,25.2 37,25.8 37,27.1 R27.2 38.5,28.3 40.5,30.3 40.5,34.6 40.7,34.8 IMU.VCC_IN | 36.4,25.2 34.5,25.2 U2.20 34.4,25.2 v31.5,25.2 | v27.7,25.2 26.9,25.2 | 36.4,25.2 36.4,18.6 | 49.3,15 41.7,15 41.7,17.3 40.4,18.6 36.4,18.6 | 17.75,18.65 18.8,19.7 v18.8,19.8
  Bottom 0.254: v31.5,25.2 v27.7,25.2 27.6,25.2 24.3,21.9 20.9,21.9 v18.8,19.8
VFB$1
  Top 0.254: R17.2 6.4,6 7,6.6 7,7.9 R16.1 7.2,8 7.7,8.5 7.7,9.4 8.3,10 HX1.4
VFB$2
  Top 0.254: R5.2 19.9,5.9 20,6 20,8 R4.1 20.1,8.1 20.1,8.2 21,9.1 21,9.4 21.6,10 HX2.4
VFB$3
  Top 0.254: R8.2 39.3,6.1 39.6,6.4 39.6,8 R7.1 39.7,8.1 39.7,10.2 39.8,10.3 HX3.4
VFB$4
  Top 0.254: R11.2 52.8,6.5 52.8,8.6 R10.1 52.8,8.7 52.8,10.3 53,10.5 HX4.4
VIN
  Bottom 0.254: REG.P$1 46.5,37.6 31.3,37.6 29.6,39.3 DXL.V+

### Text on the board
_tsilk: TTL